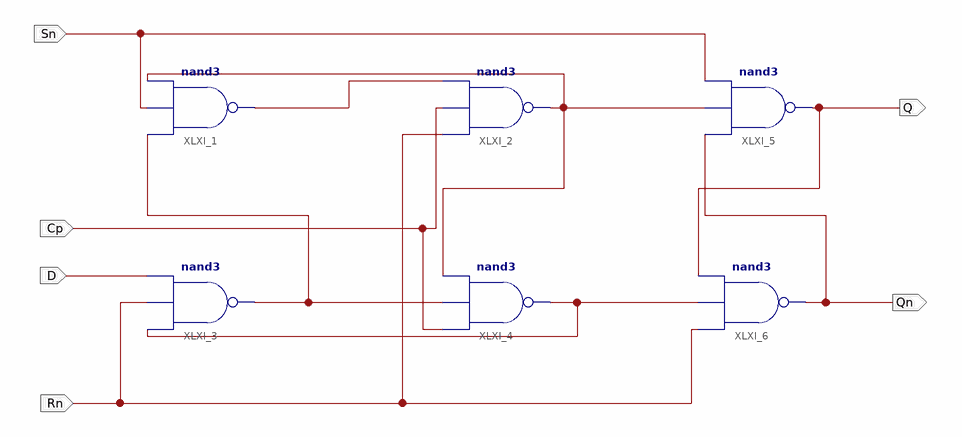
[diagram p0: schematic sheet 1]
// Xilinx ISE schematic MB_DFF.sch (kintex7) as structural Verilog: 6 symbols, 6 ports
module MB_DFF (
  input  D,
  input  Cp,
  input  Sn,
  input  Rn,
  output Q,
  output Qn
);

  wire XLXN_6, XLXN_7, XLXN_13, XLXN_14;

  nand XLXI_1 (XLXN_6, XLXN_13, Sn, XLXN_7);
  nand XLXI_2 (XLXN_7, Rn, Cp, XLXN_6);
  nand XLXI_3 (XLXN_13, XLXN_14, Rn, D);
  nand XLXI_4 (XLXN_14, Cp, XLXN_13, XLXN_7);
  nand XLXI_5 (Q, Qn, XLXN_7, Sn);
  nand XLXI_6 (Qn, Rn, XLXN_14, Q);
endmodule
